# Altium schematic sheet PL2303.SchDoc
size A4
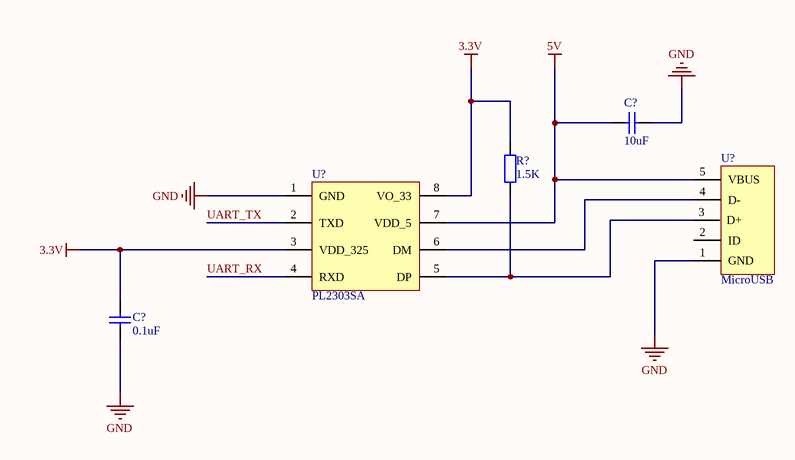
[diagram p0: PL2303.SchDoc]

## Parts
(Parts that share a designator on the sheet are numbered #1, #2 ... from top to bottom, then left to right.)
C?#1  10uF  [0603]
C?#2  0.1uF  [0603]
R?  1.5K  [0603]
U?#1  MicroUSB  [Micro-USB]
U?#2  PL2303SA  [SOP-8]

## Nets
3.3V: C?#2.2 R?.1 U?#2.3(VDD_325) U?#2.8(VO_33)
5V: C?#1.2 U?#1.5(VBUS) U?#2.7(VDD_5)
GND: C?#1.1 C?#2.1 U?#1.1(GND) U?#2.1(GND)
UART_RX: U?#2.4(RXD)
UART_TX: U?#2.2(TXD)
NetR?_2: R?.2 U?#1.3(D+) U?#2.5(DP)
NetU?#1_4: U?#1.4(D-) U?#2.6(DM)

Not connected (* = marked no-connect by the designer): U?#1 2(ID)

## Library data of the parts
C?#1 C?#2 = Cap1: ceramic
R? = Res
U?#1 = MicroUSB_B